# Altium schematic sheet Adder_Subtracter.SchDoc
size 431 x 279 mm; SheetNumber: 1; SheetTotal: 3; ENG_APP_DATE: --/--/--; DSN_APP_DATE: --/--/--; CHK_APP_DATE: --/--/--
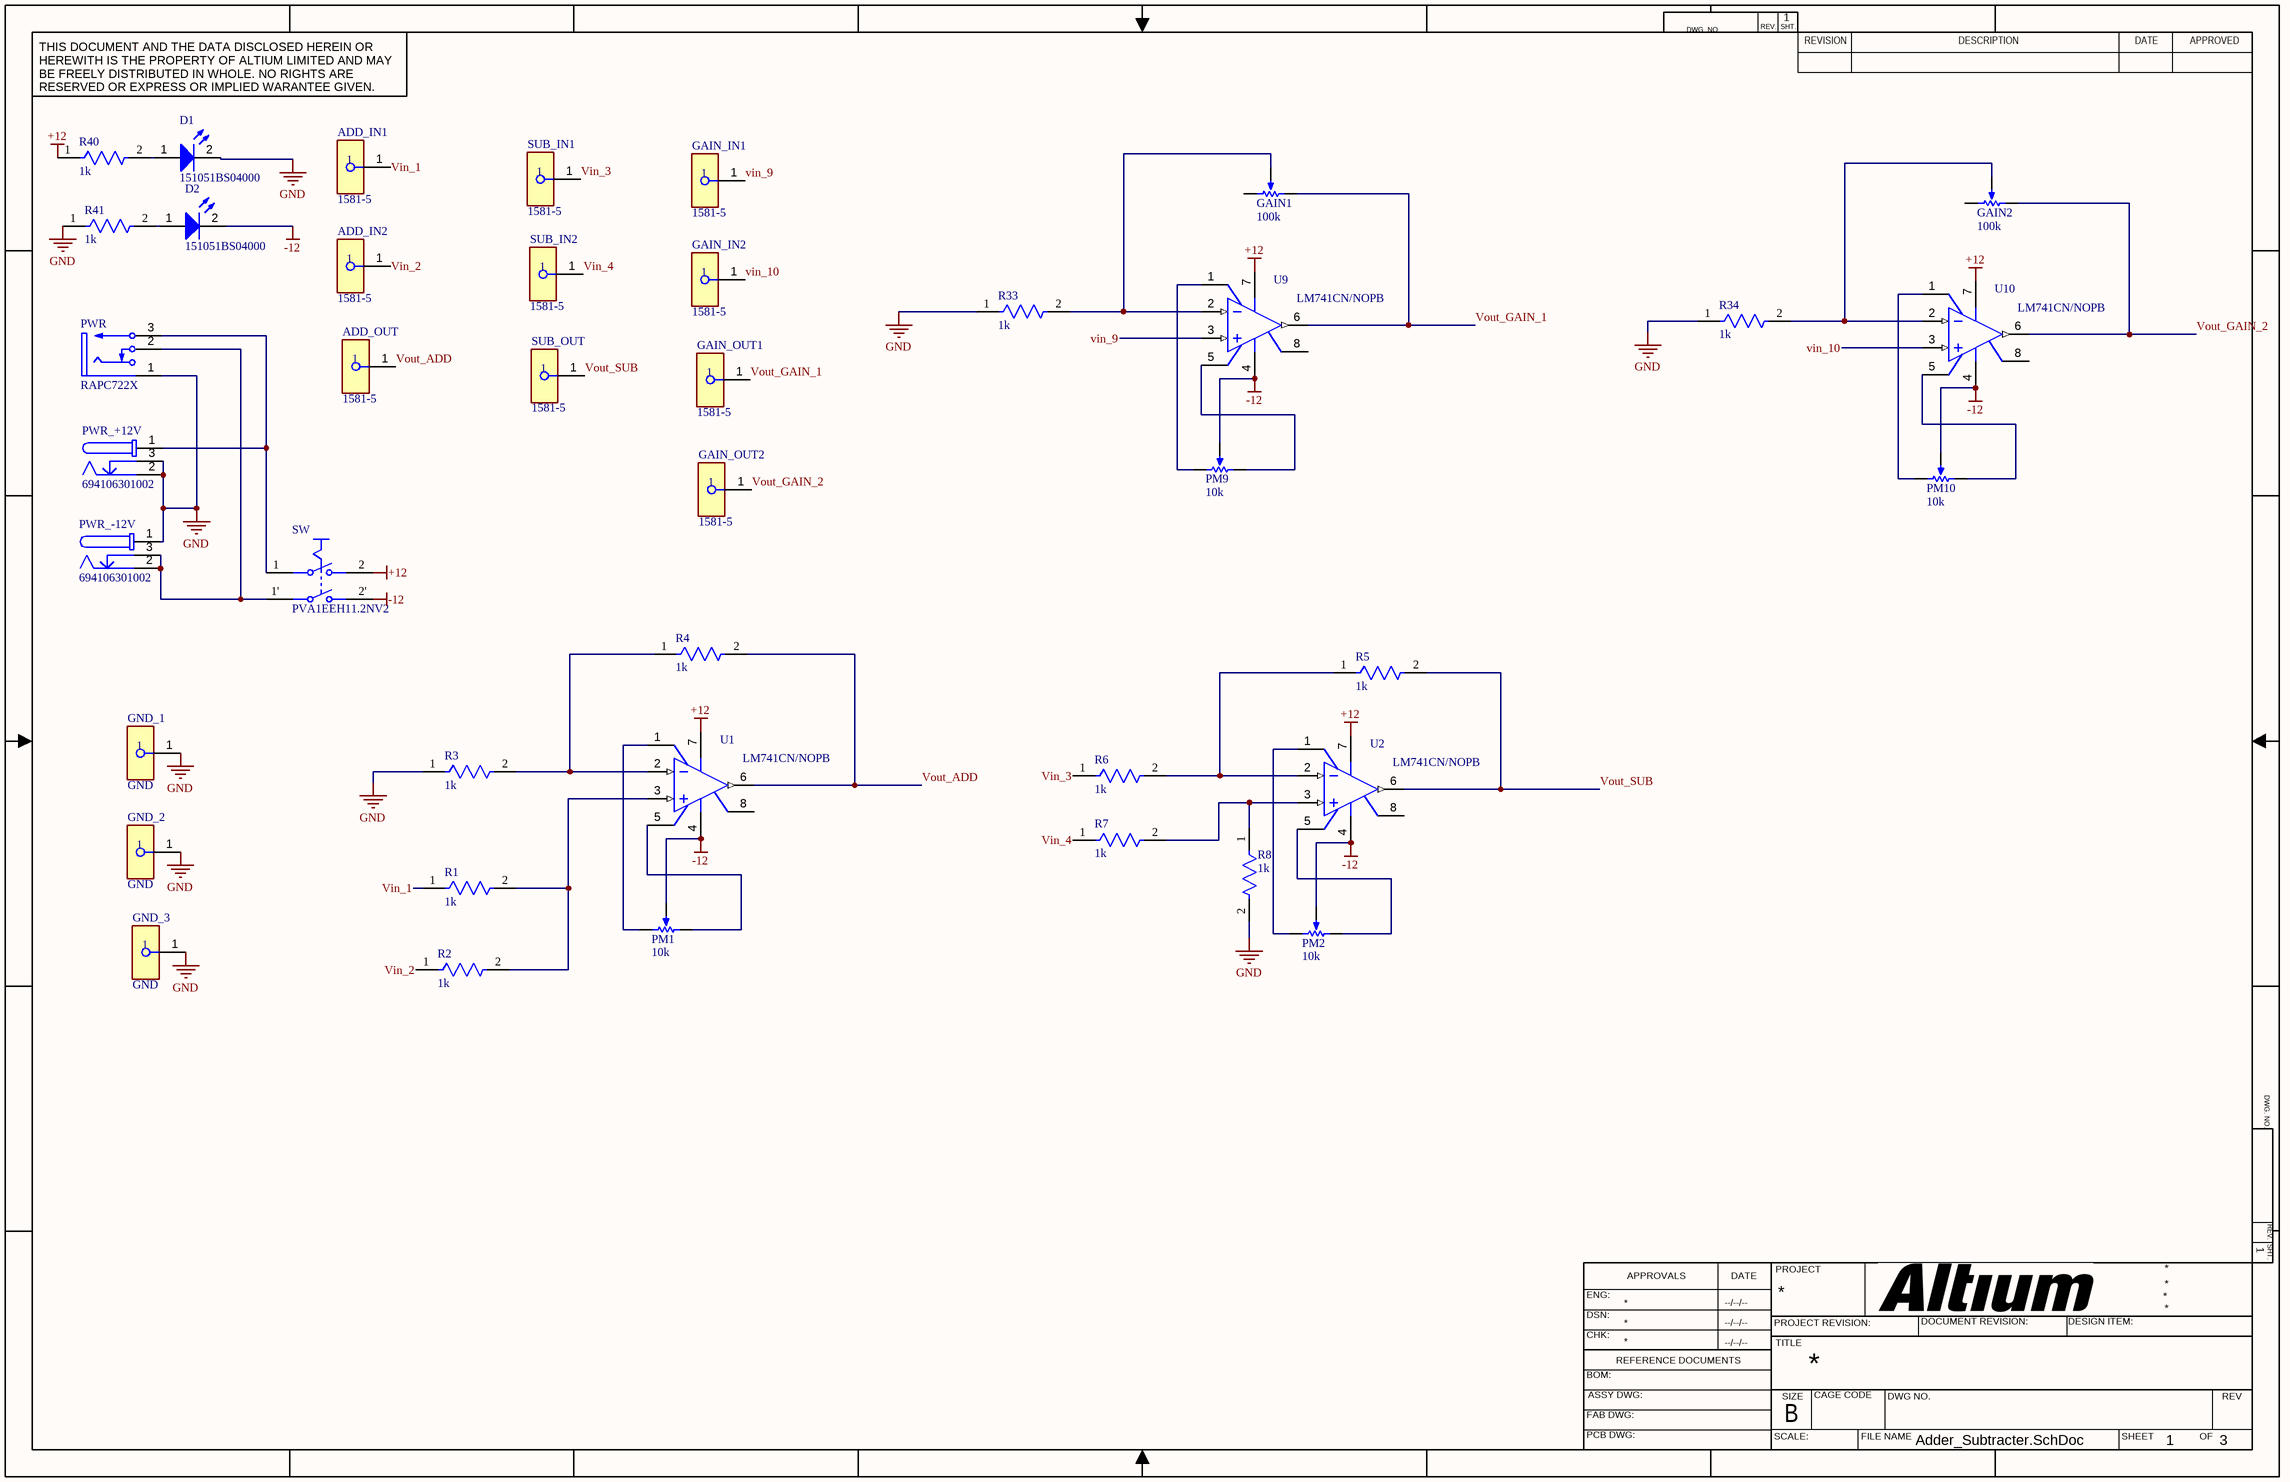
[diagram p0: Adder_Subtracter.SchDoc]

## Parts
ADD_IN1  1581-5  [FP-1581-5-MFG]
ADD_IN2  1581-5  [FP-1581-5-MFG]
ADD_OUT  1581-5  [FP-1581-5-MFG]
D1  151051BS04000  [WL-TMRC_D5.9H8.7]
D2  151051BS04000  [WL-TMRC_D5.9H8.7]
GAIN1  100k  [BOUR-3852A-282-103AL-3_V]
GAIN2  100k  [BOUR-3852A-282-103AL-3_V]
GAIN_IN1  1581-5  [FP-1581-5-MFG]
GAIN_IN2  1581-5  [FP-1581-5-MFG]
GAIN_OUT1  1581-5  [FP-1581-5-MFG]
GAIN_OUT2  1581-5  [FP-1581-5-MFG]
GND_1  GND  [FP-1581-5-MFG]
GND_2  GND  [FP-1581-5-MFG]
GND_3  GND  [FP-1581-5-MFG]
PM1  10k  [BOUR-3362P]
PM2  10k  [BOUR-3362P]
PM9  10k  [BOUR-3362P]
PM10  10k  [BOUR-3362P]
PWR  RAPC722X  [SWITCH-RAPC712X-3_V]
PWR_+12V  694106301002  [694106301002]
PWR_-12V  694106301002  [694106301002]
R1  1k  [FP-RLR07-MFG]
R2  1k  [FP-RLR07-MFG]
R3  1k  [FP-RLR07-MFG]
R4  1k  [FP-RLR07-MFG]
R5  1k  [FP-RLR07-MFG]
R6  1k  [FP-RLR07-MFG]
R7  1k  [FP-RLR07-MFG]
R8  1k  [FP-RLR07-MFG]
R33  1k  [FP-RLR07-MFG]
R34  1k  [FP-RLR07-MFG]
R40  1k  [FP-RLR07-MFG]
R41  1k  [FP-RLR07-MFG]
SUB_IN1  1581-5  [FP-1581-5-MFG]
SUB_IN2  1581-5  [FP-1581-5-MFG]
SUB_OUT  1581-5  [FP-1581-5-MFG]
SW  PVA1EEH11.2NV2  [FP-PVA1EEH11_2NV2-MFG]
U1  LM741CN/NOPB  [P0008A]
U2  LM741CN/NOPB  [P0008A]
U9  LM741CN/NOPB  [P0008A]
U10  LM741CN/NOPB  [P0008A]

## Nets
+12: R40.1 SW.2 U1.7(V+) U2.7(V+) U9.7(V+) U10.7(V+)
-12: D2.2(K) PM1.2(S) PM2.2(S) PM9.2(S) PM10.2(S) SW.2' U1.4(V-) U2.4(V-) U9.4(V-) U10.4(V-)
GND: D1.2(K) GND_1.1 GND_2.1 GND_3.1 PWR.1 PWR_+12V.2 PWR_+12V.3 PWR_-12V.1 R3.1 R8.2 R33.1 R34.1 R41.1
Vin_1: ADD_IN1.1 R1.1
Vin_2: ADD_IN2.1 R2.1
Vin_3: R6.1 SUB_IN1.1
Vin_4: R7.1 SUB_IN2.1
vin_9: GAIN_IN1.1 U9.3(IN+)
vin_10: GAIN_IN2.1 U10.3(IN+)
Vout_ADD: ADD_OUT.1 R4.2 U1.6(OUT)
Vout_GAIN_1: GAIN1.1(CCW) GAIN_OUT1.1 U9.6(OUT)
Vout_GAIN_2: GAIN2.1(CCW) GAIN_OUT2.1 U10.6(OUT)
Vout_SUB: R5.2 SUB_OUT.1 U2.6(OUT)
NetD1_1: D1.1(A) R40.2
NetD2_1: D2.1(A) R41.2
NetGAIN1_2: GAIN1.2(S) R33.2 U9.2(IN-)
NetGAIN2_2: GAIN2.2(S) R34.2 U10.2(IN-)
NetPM1_1: PM1.1(CCW) U1.5(OFS_NULL)
NetPM1_3: PM1.3(CW) U1.1(OFS_NULL)
NetPM2_1: PM2.1(CCW) U2.5(OFS_NULL)
NetPM2_3: PM2.3(CW) U2.1(OFS_NULL)
NetPM9_1: PM9.1(CCW) U9.5(OFS_NULL)
NetPM9_3: PM9.3(CW) U9.1(OFS_NULL)
NetPM10_1: PM10.1(CCW) U10.5(OFS_NULL)
NetPM10_3: PM10.3(CW) U10.1(OFS_NULL)
NetPWR_2: PWR.2 PWR_-12V.2 PWR_-12V.3 SW.1'
NetPWR_3: PWR.3 PWR_+12V.1 SW.1
NetR1_2: R1.2 R2.2 U1.3(IN+)
NetR3_2: R3.2 R4.1 U1.2(IN-)
NetR5_1: R5.1 R6.2 U2.2(IN-)
NetR7_2: R7.2 R8.1 U2.3(IN+)

Not connected (* = marked no-connect by the designer): GAIN1 3(CW); GAIN2 3(CW); U1 8(NC); U2 8(NC); U9 8(NC); U10 8(NC)

## Notes on the sheet
- DWG. NO.
- REV.
- SHT.
- THIS DOCUMENT AND THE DATA DISCLOSED HEREIN OR HEREWITH IS THE PROPERTY OF ALTIUM LIMITED AND MAY BE FREELY DISTRIBUTED IN WHOLE. NO RIGHTS ARE RESERVED OR EXPRESS OR IMPLIED WARANTEE GIVEN.
- REVISION
- DESCRIPTION
- DATE
- APPROVED
- ENG:
- APPROVALS
- PROJECT
- DSN:
- CHK:
- REFERENCE DOCUMENTS
- PROJECT REVISION:
- TITLE
- DOCUMENT REVISION:
- DESIGN ITEM:
- BOM:
- FAB DWG:
- PCB DWG:
- ASSY DWG:
- SCALE:
- SIZE
- B
- CAGE CODE
- FILE NAME
- DWG NO.
- SHEET
- OF
- REV

## Library data of the parts
ADD_IN1 ADD_IN2 ADD_OUT GAIN_IN1 GAIN_IN2 GAIN_OUT1 GAIN_OUT2 GND_1-GND_3 SUB_IN1 SUB_IN2 SUB_OUT = CMP-73906-000011-1: CONN BANANA JACK TURRET GREEN; Body Material: PC; Number of Contacts: 1; Max Current Rating: 15A; Voltage Rating (AC): 30V; Insulation: Mating End Insulated; Voltage Rating: 2.5kV; Voltage Rating (DC): 60V; Gender: Female; Height: 0.25inch; Mount: Panel; RoHS Compliant: Yes; Length: 1.22inch; Orientation: Straight; Diameter: 4.22mm; Lead Free: Lead Free; Package Quantity: 1; Termination: Turret; Current Rating: 15A; Packaging: Bag; Series: 1581; REACH SVHC: No SVHC; Number of Positions: 1; Contact Plating: Tin; Housing Color: Green; Contact Material: Brass; Insulation Material: Polycarbonate; Weight: 0.126lb; Number of Ports: 1; Color: Green; Housing Material: Polycarbonate; Width: 4inch
D1 D2 = CMP-1488-00009-2: NexarPartId: 29717812; Test Current: 20mA; Forward Voltage: 3.2V; Wavelength: 470nm; Lens Size: 5mm; Lens Style: Circular, Diffused, Round; Forward Current: 100mA; Peak Wavelength: 465nm; Viewing Angle: 40°; Luminous Intensity: 500mcd; Max Reverse Voltage (DC): 5V; Color: Blue; Case/Package: Radial; Width: 5mm; Mount: Through Hole; Min Operating Temperature: -40°C; Length: 5mm; Height: 8.6mm; Max Operating Temperature: 85°C; Packaging: Bulk; RoHS: Compliant; REACH SVHC: Unknown; Dominant Wavelength: 470nm
GAIN1 GAIN2 = CMP-2000-05079-1: Diameter Panel Control, 10 KOhm, +/- 10%, 2 W, -1 to 125 degC, 3-Pin THD, RoHS, Bulk; Manufacturer: Bourns; Temperature Coefficient: ±150ppm/degC; Number of Gangs: 1; Other Names: 3852A282103AL; Actuator Length: 0.875"(22.23mm); Resistive Material: Cermet; PCN Design/Specification: PBTResinJun/2011; Rotation: 280deg; PCN Other: MultipleChanges01/Dec/2012; Catalog Drawings: 3852SeriesSide1 / 3852SeriesSide2; Online Catalog: 3852and3856Series; Associated Product: 36-8560-ND / -KNOBINSTRUMW/DIALRND.9"DIA / 36-8555-ND / -KNOBINSTRUMSKIRTEDRND.7"DIA / 36-8556-ND / -KNOBINSTRUMSKIRTEDRND.9"DIA / 36-8565-ND / -KNOBINSTRUMDBLBARRND.7"DIA / 36-8566-ND / -KNOBINSTRUMDBLBARRND.9"DIA / 36-8568-ND / -KNOBINSTRUMSGLBARRND.7"DIA / 36-8569-ND / -KNOBINSTRUMSGLBARRND.9"DIA / 36-8559-ND / -KNOBINSTRUMW/DIALRND.7"DIA / 226-1006-ND / -KNOBBLKGLOSS.75"DIA.250"SHAFT / 226-1007-ND / -KNOBBLKGLOSS.925"DIA.250"SHAFT / 226-1011-ND / -KNOBBLKGLOS; Actuator Diameter: 0.250"(6.35mm); Built in Switch: None; Resistance (Ohms): 10k; Power (Watts): 2W; Actuator Type: Slotted; Standard Package: 45; Tolerance: ±10%; Taper: Linear; Series: 3852; Packaging: Bulk; Category: Potentiometers,VariableResistors; Bushing Thread: 3/8-32; Datasheet URL: https://datasheet.ciiva.com/11831/0900766b80f93b4b-11831016.pdf; Datasheet Version: Sep-14; Number of Turns: 1; Family: RotaryPotentiometers,Rheostats; Termination Style: SolderLug; RoHS Information: 3852A-LMaterialDeclaration; Mounting Type: PanelMount; Manufacturer URL: http://www.bourns.com/
PM1 PM2 PM9 PM10 = CMP-1747-00004-1: Square Trimpot(R) Trimming Potentiometer, 10 KOhm, 300 V, -55 to 125 degC, 3-Pin THD, RoHS, Tube; Voltage Rating: 220 mV; Power Rating: 1 W; Tolerance: 1%; Resistance: 50 mohm; Case/Package: 1206; Length: 3.2 mm; RoHSCompliant: True; PackageDescription: 3-Pin Through Hole Device, Body 6.6 x 6.99 mm, Pitch 2.54 mm; ComponentLink2Description: Datasheet; REACH SVHC: No SVHC; Mount: Surface Mount; Height: 0.6 mm; Packaging: Tape and Reel; ComponentLink1URL: http://www.bourns.com/; Case Code (Imperial): 0612; Pins: 2; Case Code (Metric): 1632; ComponentLink2URL: http://www.bourns.com/docs/Product-Datasheets/3362.pdf; Min Operating Temperature: -25degC; ComponentLink1Description: Manufacturer URL; PackageReference: 3326P; Max Operating Temperature: 125degC; Width: 1.6 mm; Package Quantity: 5000; DatasheetVersion: May-16
PWR = CMP-2000-05384-1: Power Jack, 5 A, 3-Pin THD, RoHS, Bulk; Manufacturer: Switchcraft; Current Rating: 5A; Plug/Mating Plug Diameter: 2.1mmID,5.5mmOD; Gender: Male; Mating Products: S765-ND / -CONNPLUGMINIPWR2CONDWHT/RED / S760K-ND / -CONNPOWERPLUGMINI.08"BLACK / SC1052-ND / -CONNPOWERPLUGMINIBLACK; Number of Positions/Contacts: 2Conductors,2Contacts; Internal Switch(s): SingleSwitch,NormallyClosed; Shielding: Unshielded; Catalog Drawings: RAPC7(1,2)2XSide / RAPC7(1,2)2XTop; Dynamic Catalog: SwitchcraftInc; Other Names: Q2287470A / RAPC722X-ND / SC1313; Standard Package: 2,500; Termination: SolderEyelet(s); Family: Barrel-PowerConnectors; Housing Color: Black; Housing Material: Thermoplastic; RoHS Information: SwitchcraftRoHSInfo; Color: Black; Contact Material - Plating: Nickel; Mounting Type: ThroughHole,RightAngle; Manufacturer URL: http://www.switchcraft.com/; Contact Material: Brass; Datasheet Version: Rev. A, 08/2005; Connector Type: Jack; Category: Connectors,Interconnects; Datasheet URL: http://www.mouser.com/ds/2/393/rapc722x_cd-371352.pdf
PWR_+12V PWR_-12V = CMP-1502-00188-2: NexarPartId: 52676100; Voltage Rating (DC): 20V; Gender: Male; Voltage Rating: 24V; Connector Type: Power; Insulation Resistance: 100MΩ; Current Rating: 5A; Shielding: Unshielded; Number of Contacts: 3; Color: Black; Housing Material: Polyamide; Contact Gender: Female; REACH SVHC: Unknown; Termination: Through Hole; Height: 11mm; RoHS: Compliant; Mount: Through Hole; Flammability Rating: UL94 V-0; Packaging: Bulk; Min Operating Temperature: -40°C; Contact Plating: Tin; Max Operating Temperature: 85°C; Operating Supply Voltage: 24V; Contact Material: Gold, Tin
R1-R8 R33 R34 R40 R41 = CMP-00030-39447724-1: RLR07C1001FSB14 Fixed Resistor, Metal Film, 0.25W, 1000ohm, 250V, 1% +/-Tol, 100ppm/Cel, Through Hole Mount; Wire/Cable Diameter: 50.8µm; Lead Diameter: 640µm; Max Power Dissipation: 250mW; Temperature Coefficient: 100ppm/°C; Resistance: 1kΩ; Lead Length: 38.1mm; Value: 1kΩ; Voltage Rating: 250V; Lead Free: Contains Lead; REACH SVHC: Unknown; Packaging: Bulk; Military Standard: MIL-PRF-39017; Width: 2.29mm; Max Operating Temperature: 150°C; Length: 7.62mm; Min Operating Temperature: -65°C; Composition: Metal Film; Diameter: 2.29mm; Radiation Hardening: No; Features: Military, Moisture Resistant, Weldable; Failure Rate: 0.001%; Case/Package: Conformal; Tolerance: 1%; Voltage Rating (DC): 250V; Schedule B: 8533210090, 8533210090; RoHS: Non-Compliant; Termination: Axial; Power Rating: 250mW; Contact Plating: Lead, Tin; NexarPartId: 39447724; Number of Terminations: 2; Number of Pins: 14
SW = CMP-10035-000009-1: SWITCH PUSH DPST 0.1A 32V; Switch Function: Off-On; Current Rating: 100mA; Electrical Life: 100000Cycles; RoHS Compliant: Yes; Throw Configuration: DPST; Max Operating Temperature: 85°C; Voltage Rating (DC): 32V; Mount: Through Hole; Series: PVA; Min Operating Temperature: -40°C; Termination: PC Pin; Packaging: Bulk
U1 U2 U9 U10 = CMP-0055-00162-3: Operational Amplifier, 8-pin MDIP, Pb-Free; Manufacturer: Texas Instruments; PackageTopMarking: NSUZXYTTE#*LM*741CN; PowerWise: N; CompType: Amplifiers; ComponentLink1Description: Datasheet URL; ComponentLink1URL: http://www.ti.com/general/docs/lit/getliterature.tsp?genericPartNumber=LM741&fileType=pdf; PackageDescription: MDIP, .365 x .250 x .130in, 8 Lead, .100in Pitch; RoHS: Y; PinCount: 8; Code_JEDEC: MS-001-BA; Package Reference: P0008A